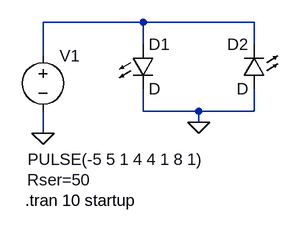
[diagram p0: schematic LTSpice_Example_001.asc]
LTSpice_Example_001.asc, the LTspice schematic file:
Version 4
SHEET 1 880 680
WIRE 320 224 176 224
WIRE 480 224 320 224
WIRE 320 256 320 224
WIRE 480 256 480 224
WIRE 176 272 176 224
WIRE 320 352 320 320
WIRE 400 352 320 352
WIRE 480 352 480 320
WIRE 480 352 400 352
WIRE 400 368 400 352
WIRE 176 384 176 352
FLAG 400 368 0
FLAG 176 384 0
SYMBOL voltage 176 256 R0
WINDOW 3 -22 165 Left 2
WINDOW 123 0 0 Left 2
WINDOW 39 -23 195 Left 2
SYMATTR InstName V1
SYMATTR Value PULSE(-5 5 1 4 4 1 8 1)
SYMATTR SpiceLine Rser=50
SYMBOL LED 304 256 R0
SYMATTR InstName D1
SYMBOL LED 496 320 R180
WINDOW 0 24 64 Left 2
WINDOW 3 24 0 Left 2
SYMATTR InstName D2
TEXT 150 480 Left 2 !.tran 10 startup

The netlist it stands for:
* LTSpice_Example_001.asc
V1 N001 0 PULSE(-5 5 1 4 4 1 8 1) Rser=50
D1 N001 0 D
D2 0 N001 D
.model D D
.lib standard.dio
.tran 10 startup
.backanno
.end